# EAGLE design 国技館_IM920sL (EAGLE 9.6.2)
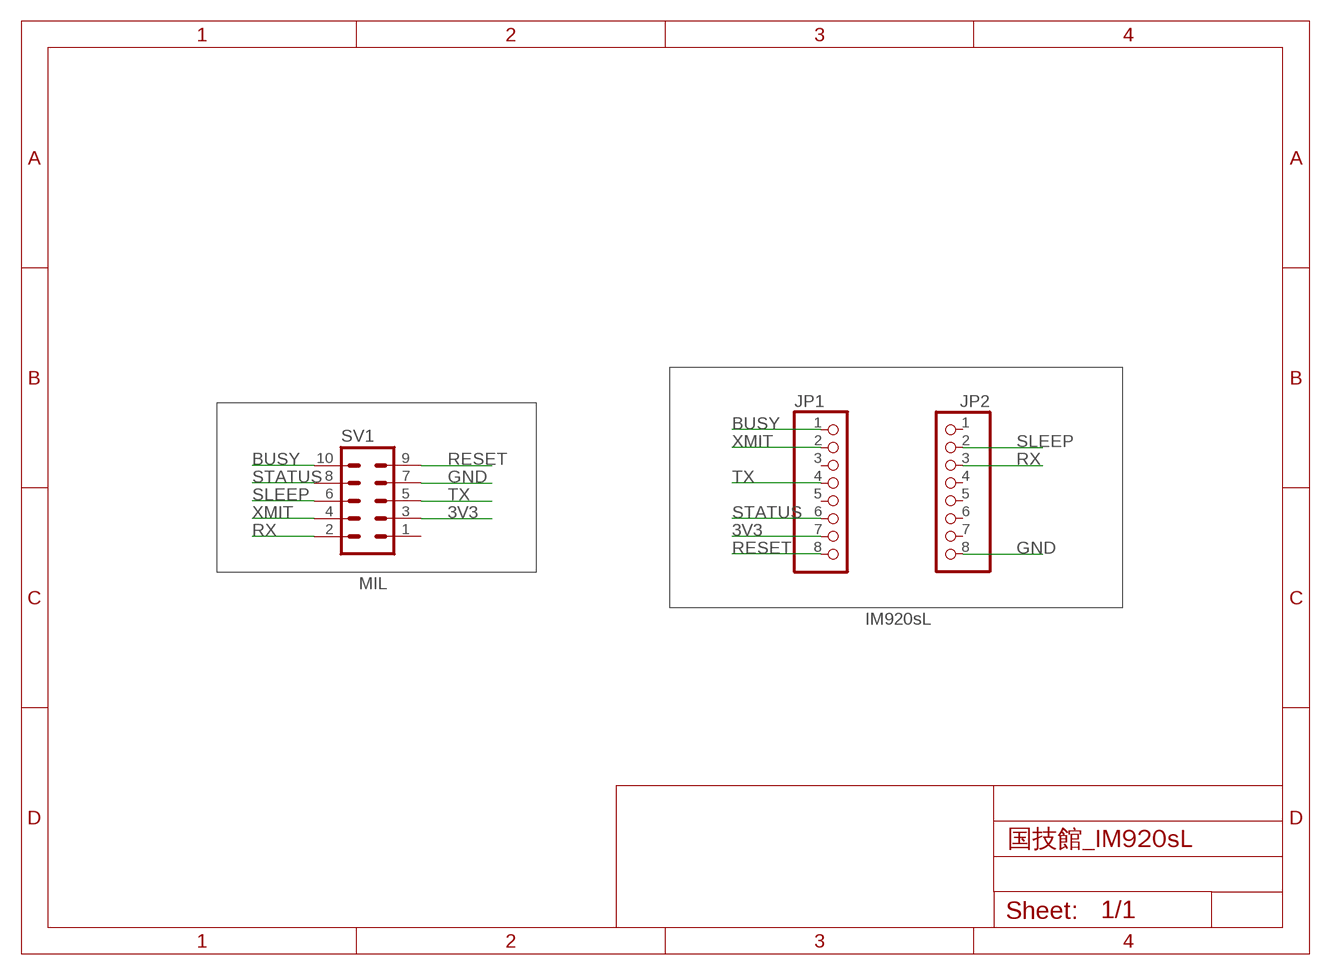
[diagram p0: schematic, sheet 1]

## Parts
JP1  PINHD-1X8  [1X08]
JP2  PINHD-1X8  [1X08]
SV1  ML10  [ML10]

## Nets
3V3: JP1.7 SV1.3
BUSY: JP1.1 SV1.10
GND: JP2.8 SV1.7
RESET: JP1.8 SV1.9
RX: JP2.3 SV1.2
SLEEP: JP2.2 SV1.6
STATUS: JP1.6 SV1.8
TX: JP1.4 SV1.5
XMIT: JP1.2 SV1.4
Unconnected: JP1.3 JP1.5 JP2.1 JP2.4 JP2.5 JP2.6 JP2.7 SV1.1

## Notes on the sheet
- MIL
- IM920sL

## Library data of the parts
JP1 JP2 = pinhead:PINHD-1X8: PIN HEADER
SV1 = con-ml:ML10: HARTING; OC_FARNELL: unknown; OC_NEWARK: unknown

## Board
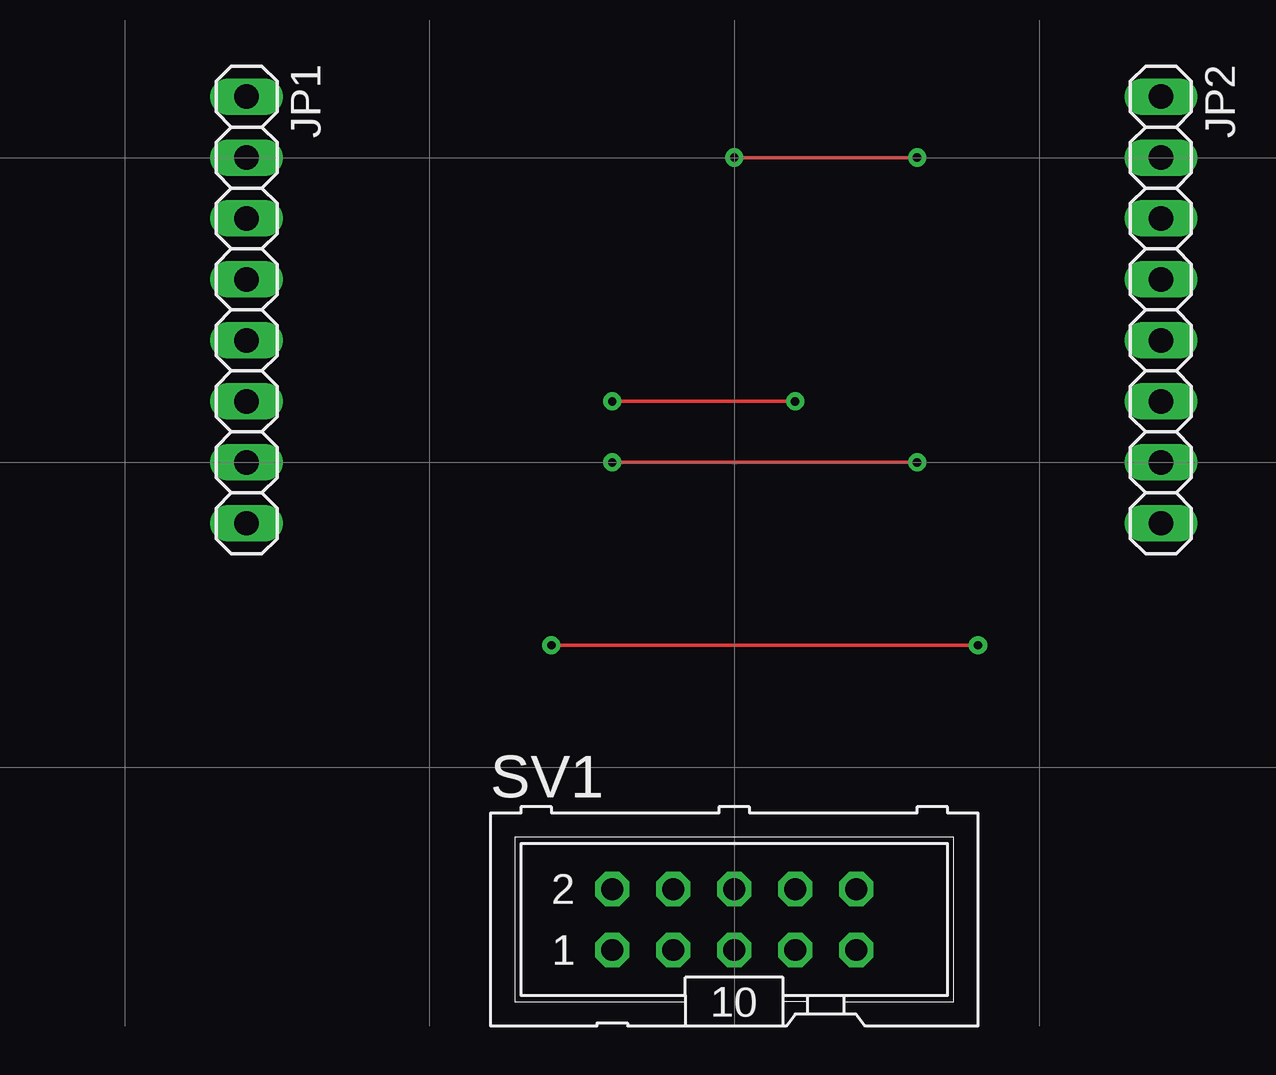
[diagram p1: board, top side]
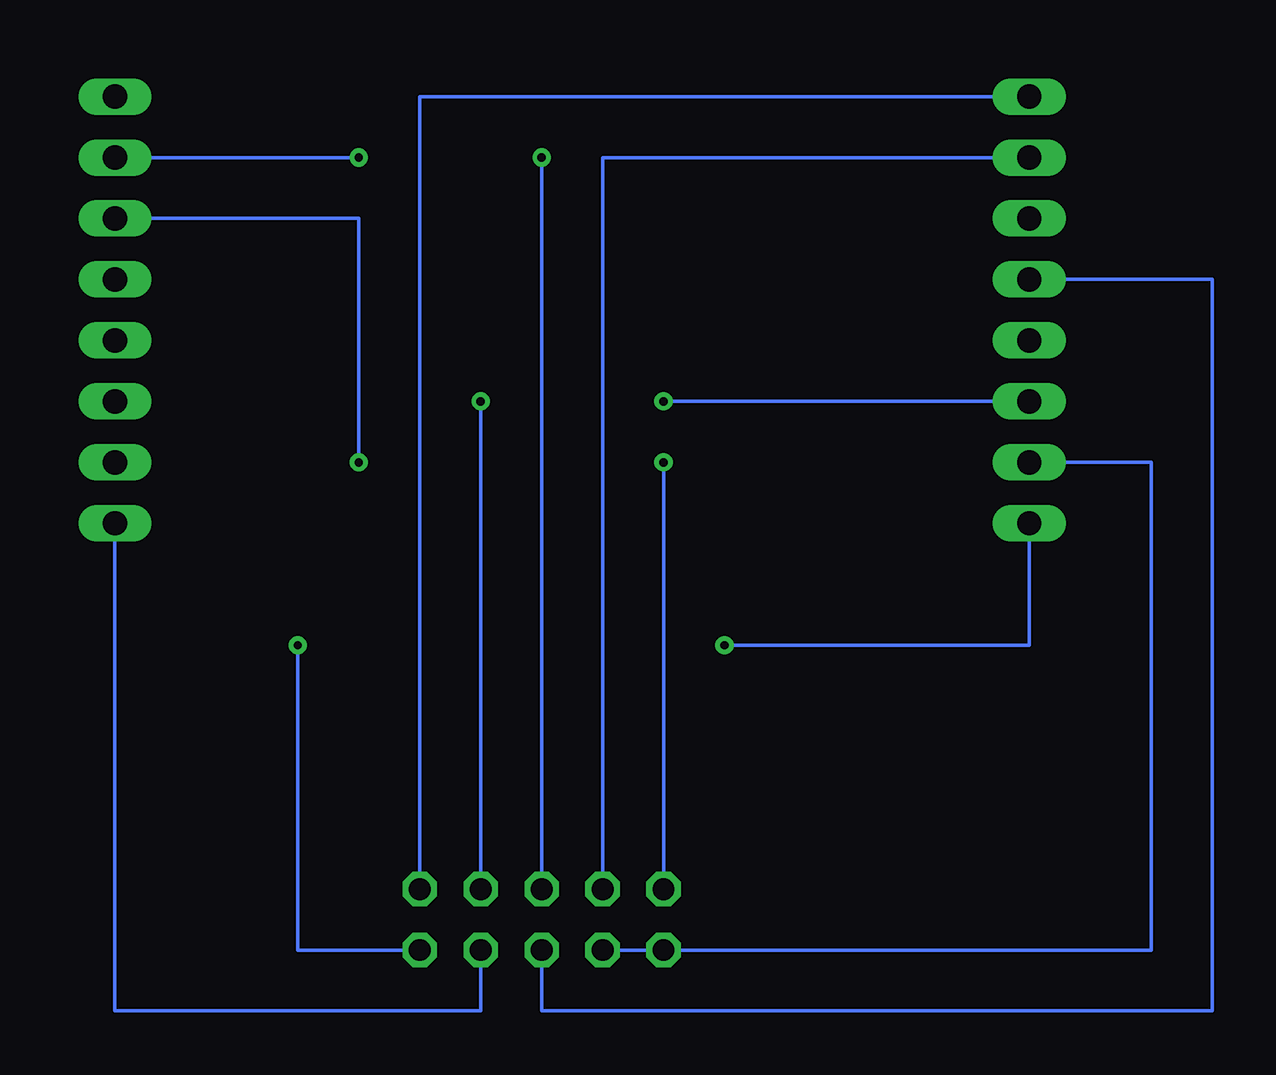
[diagram p2: board, bottom side, seen from below]

No outline drawn. Coordinates in mm, seen from the top.
Copper layers (1*16): Top 0.035mm / dielectric 1.5mm / Bottom 0.035mm
Design rules "default": minimum track width 6mil, minimum drill 0.35mm, track to track 6mil, track to pad 6mil, pad to pad 6mil, via to via 6mil, smd to smd 6mil, copper to edge 40mil, drill to drill 6mil, minimum pad ring 10mil, minimum via ring 8mil, stop-mask expansion 4mil, vias tented up to drill 0mil, thermal gap 10mil

### Footprints (pad centres in the part's own frame; a part is rotated, then mirrored left to right if it is on the bottom)
1X08 = drill 1.016 long: 1 -8.89,0; 2 -6.35,0; 3 -3.81,0; 4 -1.27,0; 5 1.27,0; 6 3.81,0; 7 6.35,0; 8 8.89,0
ML10 = drill 0.914 octagon: 1 -5.08,-1.27; 2 -5.08,1.27; 3 -2.54,-1.27; 4 -2.54,1.27; 5 0,-1.27; 6 0,1.27; 7 2.54,-1.27; 8 2.54,1.27; 9 5.08,-1.27; 10 5.08,1.27

### Placement (x,y rotation side)
JP1  17.78,31.75 270 top
JP2  55.88,31.75 270 top
SV1  38.1,6.35 0 top
U$1  [TYPE.C]  0,0 0 top

### Tracks (layer width: path | path; a pad name or v marks a point on that pad's centre or on a via)
3V3
  Bottom 0.152: JP1.7 12.7,25.4 12.7,5.08 SV1.3
BUSY
  Bottom 0.152: JP1.1 43.18,40.64 SV1.10
GND
  Bottom 0.152: SV1.7 40.64,2.54 55.88,2.54 JP2.8
RESET  (via drill 0.35)
  Top 0.152: v48.26,17.78 v30.48,17.78
  Bottom 0.152: SV1.9 48.26,5.08 v48.26,17.78 | v30.48,17.78 17.78,17.78 JP1.8
RX  (via drill 0.35)
  Top 0.152: v45.72,25.4 v33.02,25.4
  Bottom 0.152: JP2.3 45.72,35.56 v45.72,25.4 | v33.02,25.4 SV1.2
SLEEP  (via drill 0.35)
  Top 0.152: v38.1,38.1 v45.72,38.1
  Bottom 0.152: SV1.6 v38.1,38.1 | v45.72,38.1 JP2.2
STATUS  (via drill 0.35)
  Top 0.152: v40.64,27.94 v33.02,27.94
  Bottom 0.152: SV1.8 v40.64,27.94 | v33.02,27.94 JP1.6
TX
  Bottom 0.152: SV1.5 38.1,2.54 10.16,2.54 10.16,33.02 JP1.4
XMIT
  Bottom 0.152: SV1.4 35.56,38.1 JP1.2